# Altium schematic sheet LightSensor_SCH.SchDoc
size A
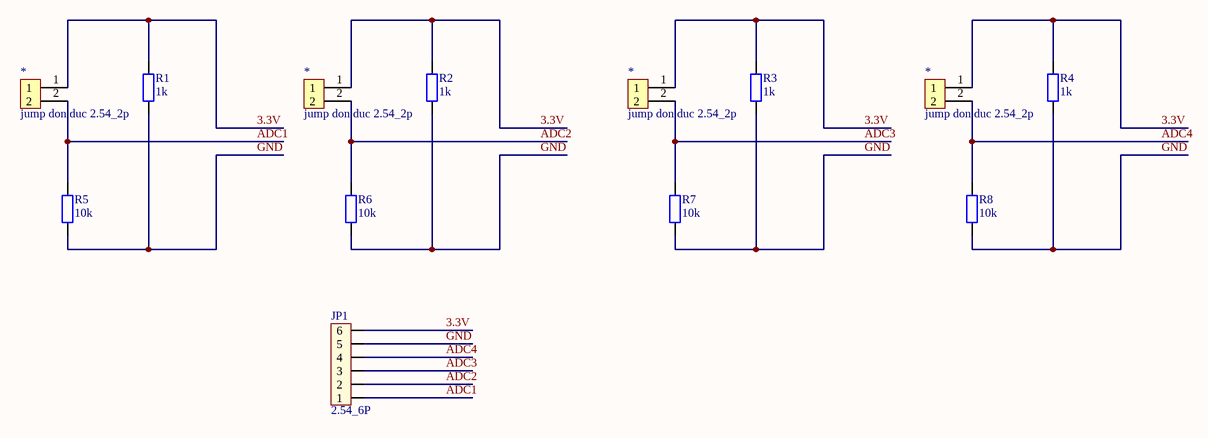
[diagram p0: LightSensor_SCH.SchDoc]

## Parts
(Parts that share a designator on the sheet are numbered #1, #2 ... from top to bottom, then left to right.)
*#1  jump don duc 2.54_2p  [jump don duc_2p]
*#2  jump don duc 2.54_2p  [jump don duc_2p]
*#3  jump don duc 2.54_2p  [jump don duc_2p]
*#4  jump don duc 2.54_2p  [jump don duc_2p]
JP1  2.54_6P  [JP6]
R1  1k  [tro vach 1/4w]
R2  1k  [tro vach 1/4w]
R3  1k  [tro vach 1/4w]
R4  1k  [tro vach 1/4w]
R5  10k  [tro vach 1/4w]
R6  10k  [tro vach 1/4w]
R7  10k  [tro vach 1/4w]
R8  10k  [tro vach 1/4w]

## Nets
3.3V: *#1.1 *#2.1 *#3.1 *#4.1 JP1.6 R1.2 R2.2 R3.2 R4.2
ADC1: *#1.2 JP1.1 R5.2
ADC2: *#2.2 JP1.2 R6.2
ADC3: *#3.2 JP1.3 R7.2
ADC4: *#4.2 JP1.4 R8.2
GND: JP1.5 R1.1 R2.1 R3.1 R4.1 R5.1 R6.1 R7.1 R8.1

## Library data of the parts
JP1 = Jum Don Duc 2.54_6P: Cắm; Ten_Linh_Kien: Jump Đơn Đực 2.54MM 1x40P Thẳng 11MM; Ma_Hang: MH000903; Don_Vi: Con; Kieu_Chan: *; Ghi_Chu: *; Chung_Loai: Cắm
R1-R4 = Tro Vach 1/4W 5% 1k: Cắm; Don_Vi: Con; So_Chan: 2; Ten_Linh_Kien: Trở Vạch 1/4w 5% 1k; Ma_Hang: MH007390; Chung_Loai: Cắm; Kieu_Chan: *
R5-R8 = Tro Vach 1/4W 5% 10k: Căm; Chung_Loai: Cắm; Don_Vi: Con; So_Chan: 2; Ten_Linh_Kien: Trở Vạch 1/4w 5% 10K; Ma_Hang: MH007354; Kieu_Chan: *